# EAGLE design test3 (EAGLE 9.5.1)
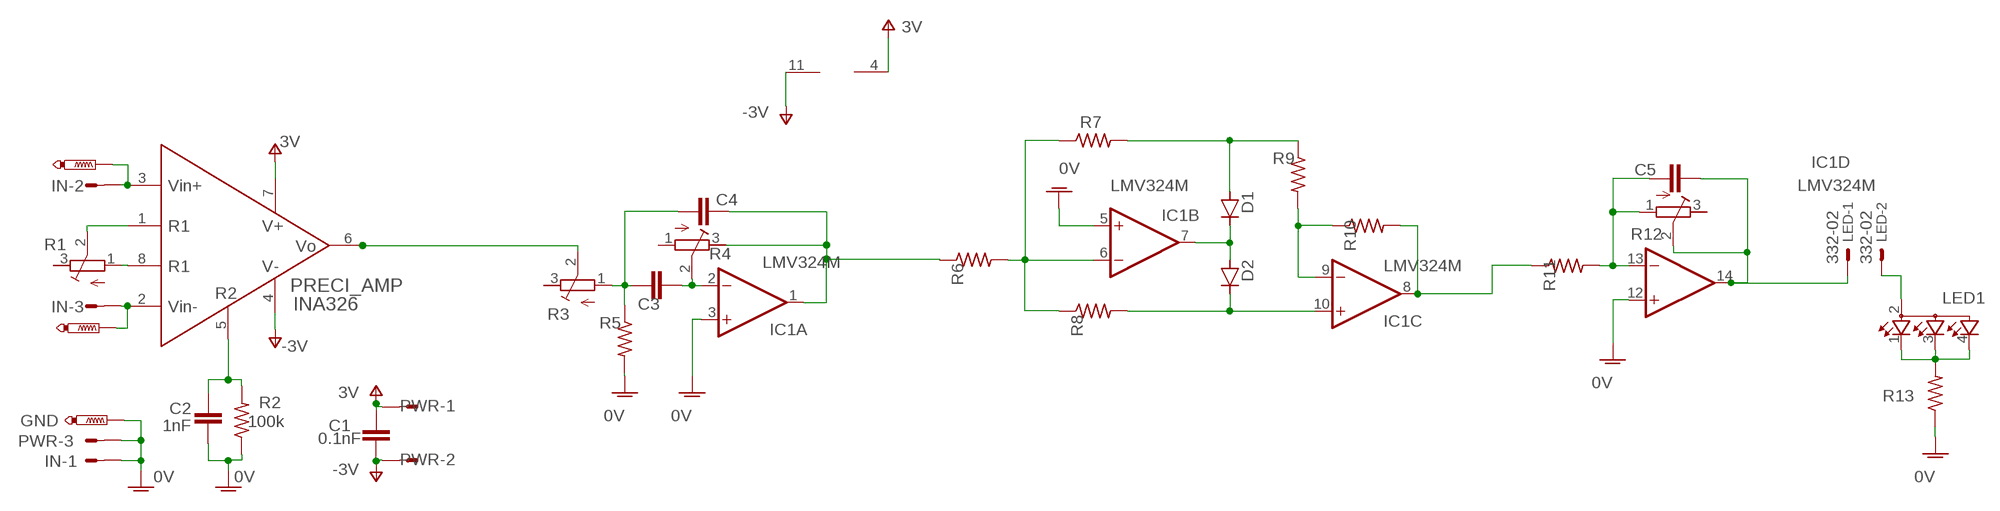
[diagram p0: schematic, sheet 1]

## Parts
C1  0.1nF  C-EUC0603  [C0603]
C2  1nF  C-EUC0603  [C0603]
C3  0.1nF  C-EUC0603  [C0603]
C4  0.1nF  C-EUC0603  [C0603]
C5  0.1nF  C-EUC0603  [C0603]
D1  D-SOD-80  [SOD80]
D2  D-SOD-80  [SOD80]
GND  PTR1PAD1-13  [P1-13]
IC1  LMV324M  [SO14]
IN  MT6-3  [MT6-3]
IN+  PTR1PAD1-13  [P1-13]
IN-  PTR1PAD1-13  [P1-13]
LED  332-02  [332-02]
LED1  TOPLED-3  [P-LCC-4-3]
PRECI_AMP  INA326  INA326EA/250  [SOP65P490X110-8N]
PWR  MT6-3  [MT6-3]
R1  R-TRIMM4G/J  [RTRIM4G/J]
R2  100k  R-US_R0603  [R0603]
R3  R-TRIMM4G/J  [RTRIM4G/J]
R4  R-TRIMM4G/J  [RTRIM4G/J]
R5  100k  R-US_R0603  [R0603]
R6  100k  R-US_R0603  [R0603]
R7  100k  R-US_R0603  [R0603]
R8  100k  R-US_R0603  [R0603]
R9  100k  R-US_R0603  [R0603]
R10  100k  R-US_R0603  [R0603]
R11  100k  R-US_R0603  [R0603]
R12  R-TRIMM4G/J  [RTRIM4G/J]
R13  100k  R-US_R0603  [R0603]

## Nets
GNDA: C2.1 GND.TP IC1.3(A:+IN) IC1.5(B:+IN) IC1.12(D:+IN) IN.1 PWR.3 R2.1 R5.2 R13.1 ; supply symbol labelled 0V
N$1: PRECI_AMP.8(R1) R1.1(A)
N$2: PRECI_AMP.1(R1_2) R1.2(S)
N$3: IN+.TP IN.2 PRECI_AMP.3(VIN+)
N$4: C2.2 PRECI_AMP.5(R2) R2.2
N$5: IN-.TP IN.3 PRECI_AMP.2(VIN-)
N$6: C3.1 IC1.2(A:-IN) R4.2(S)
N$7: C3.2 C4.2 R3.1(A) R5.1
N$8: C5.1 IC1.13(D:-IN) R11.2 R12.1(A)
N$9: PRECI_AMP.6(VO) R3.2(S)
N$10: IC1.6(B:-IN) R6.2 R7.1 R8.1
N$11: D2.1(C) IC1.10(C:+IN) R8.2
N$12: IC1.9(C:-IN) R9.2 R10.1
N$13: D1.1(C) D2.2(A) IC1.7(B:OUT)
N$14: D1.2(A) R7.2 R9.1
N$15: IC1.8(C:OUT) R10.2 R11.1
N$16: C5.2 IC1.14(D:OUT) LED.1 R12.2(S)
N$17: LED1.1(CRED) LED1.3(CBLUE) LED1.4(CGREEN) R13.2
N$20: LED1.2(A2) LED.2
N$23: C4.1 IC1.1(A:OUT) R4.3(E) R6.1
V+: C1.1 IC1.4(P:V+) PRECI_AMP.7(V+) PWR.1 ; supply symbol labelled 3V
V-: C1.2 IC1.11(P:V-) PRECI_AMP.4(V-) PWR.2 ; supply symbol labelled -3V
Unconnected: R1.3(E) R3.3(E) R4.1(A) R12.3(E)

## Library data of the parts
C1-C5 = rcl:C-EU: CAPACITOR, European symbol; SPICEPREFIX: C
D1 D2 = semicon-smd-ipc:D-: DIODE unfilled
GND IN+ IN- = testpad:PTR1: TEST PIN
IC1 = linear:LMV324?*: Quad General Purpose, Low Voltage, Rail-to-Rail Output Operational Amplifiers Source: http://www.national.com/mpf/LM/LMV321.html http://www.national.com/dt/lmv_qual.pdf; SPICEPREFIX: J
IN PWR = con-amp-mt6:MT6-3: AMP MT6 CONNECTOR; OC_FARNELL: unknown; OC_NEWARK: unknown
LED = con-garry:332-02: 2 Pin - 2mm Dual Row Source: www.mpe-connector.de / garry_shortform_2012.pdf
LED1 = led:TOPLED-3: OSRAM - Hyper Multi TOPLED® (RGB) LB E673, LV E673, LT E673 - Power TOPLED® Enhanced optical Power LED (HOP2000) LS E67B, LA E67B, LO E67B, LY E67B - Hyper Multi TOPLED® Enhanced optical Power LED (HOP2000 / ATON®) LATB T66B - Hyper Multi TOPLED® Hyper-Bright LED LATB T686 Source: http://www.osram.convergy.de/
PRECI_AMP = INA326EA_250:INA326EA/250: Precision, Rail-to-Rail I/O INSTRUMENTATION AMPLIFIER; DESCRIPTION: Precision, Low Drift, CMOS Instrumentation Amplifier 8-VSSOP -40 to 85; DIGI-KEY_PART_NUMBER: 296-15312-1-ND; DIGI-KEY_PURCHASE_URL: https://www.digikey.com/product-detail/en/texas-instruments/INA326EA-250/296-15312-1-ND/568254?utm_source=snapeda&utm_medium=aggregator&utm_campaign=symbol; MF: Texas Instruments; MP: INA326; PACKAGE: MSOP-8 Texas Instruments
R1 R3 R4 R12 = trimmer:R-TRIMM: Trimm resistor; SPICEMODEL: X; SPICEPREFIXL: POT
R2 R5-R11 R13 = rcl:R-US_: RESISTOR, American symbol; SPICEPREFIX: R

## Board
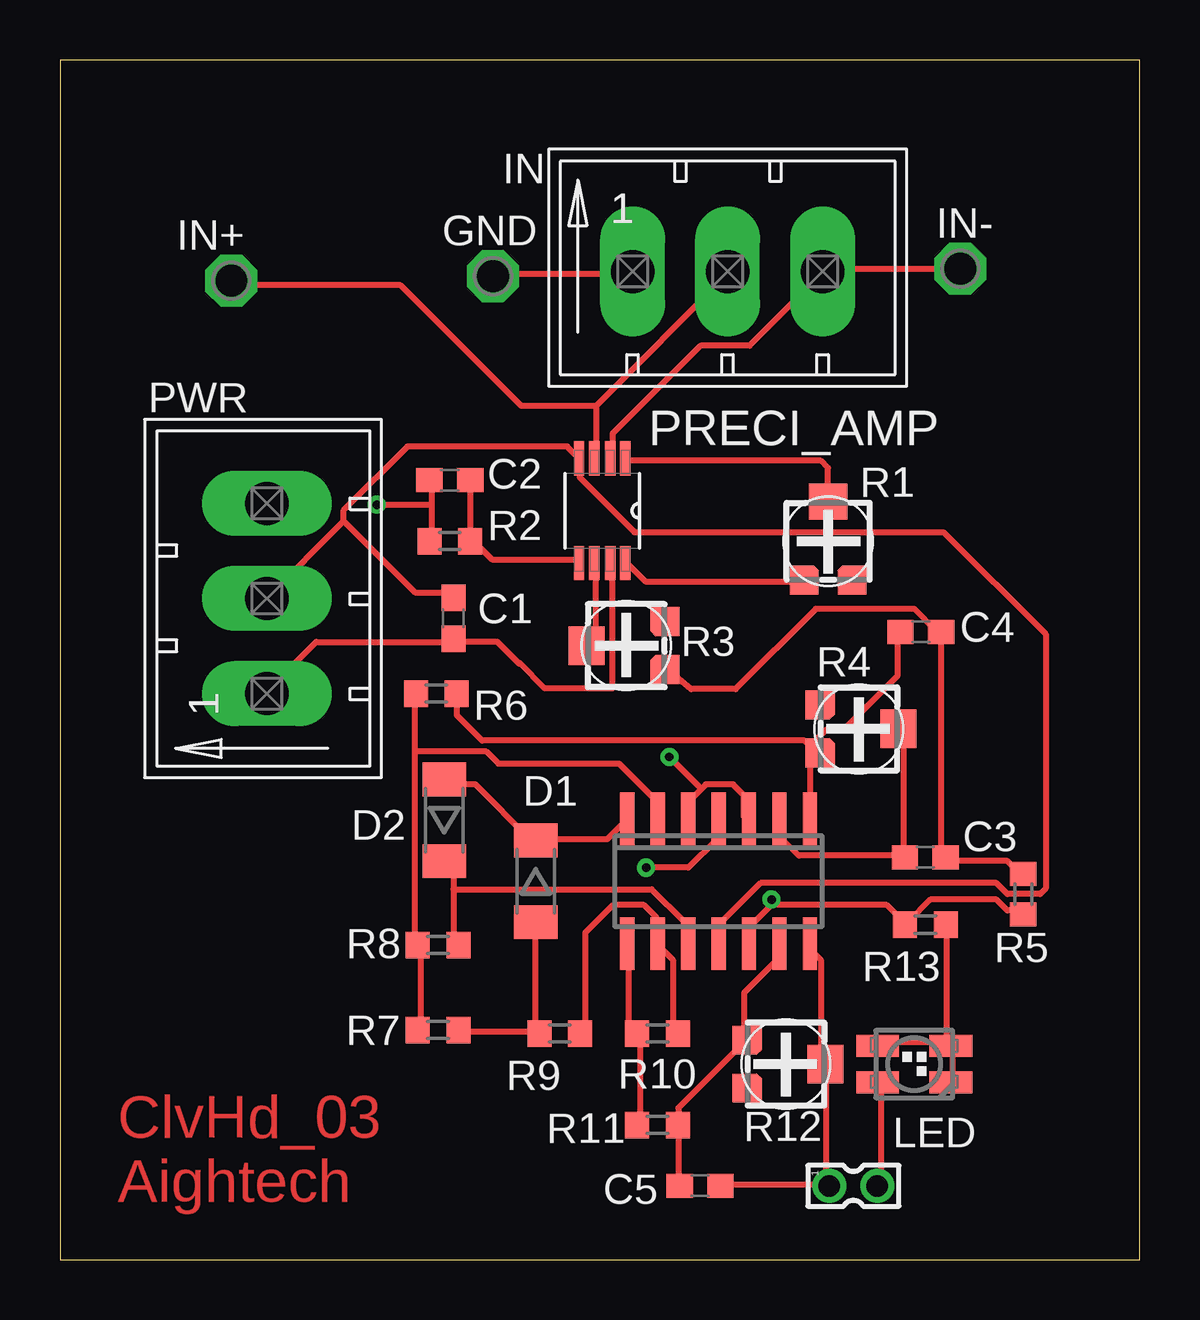
[diagram p1: board, top side]
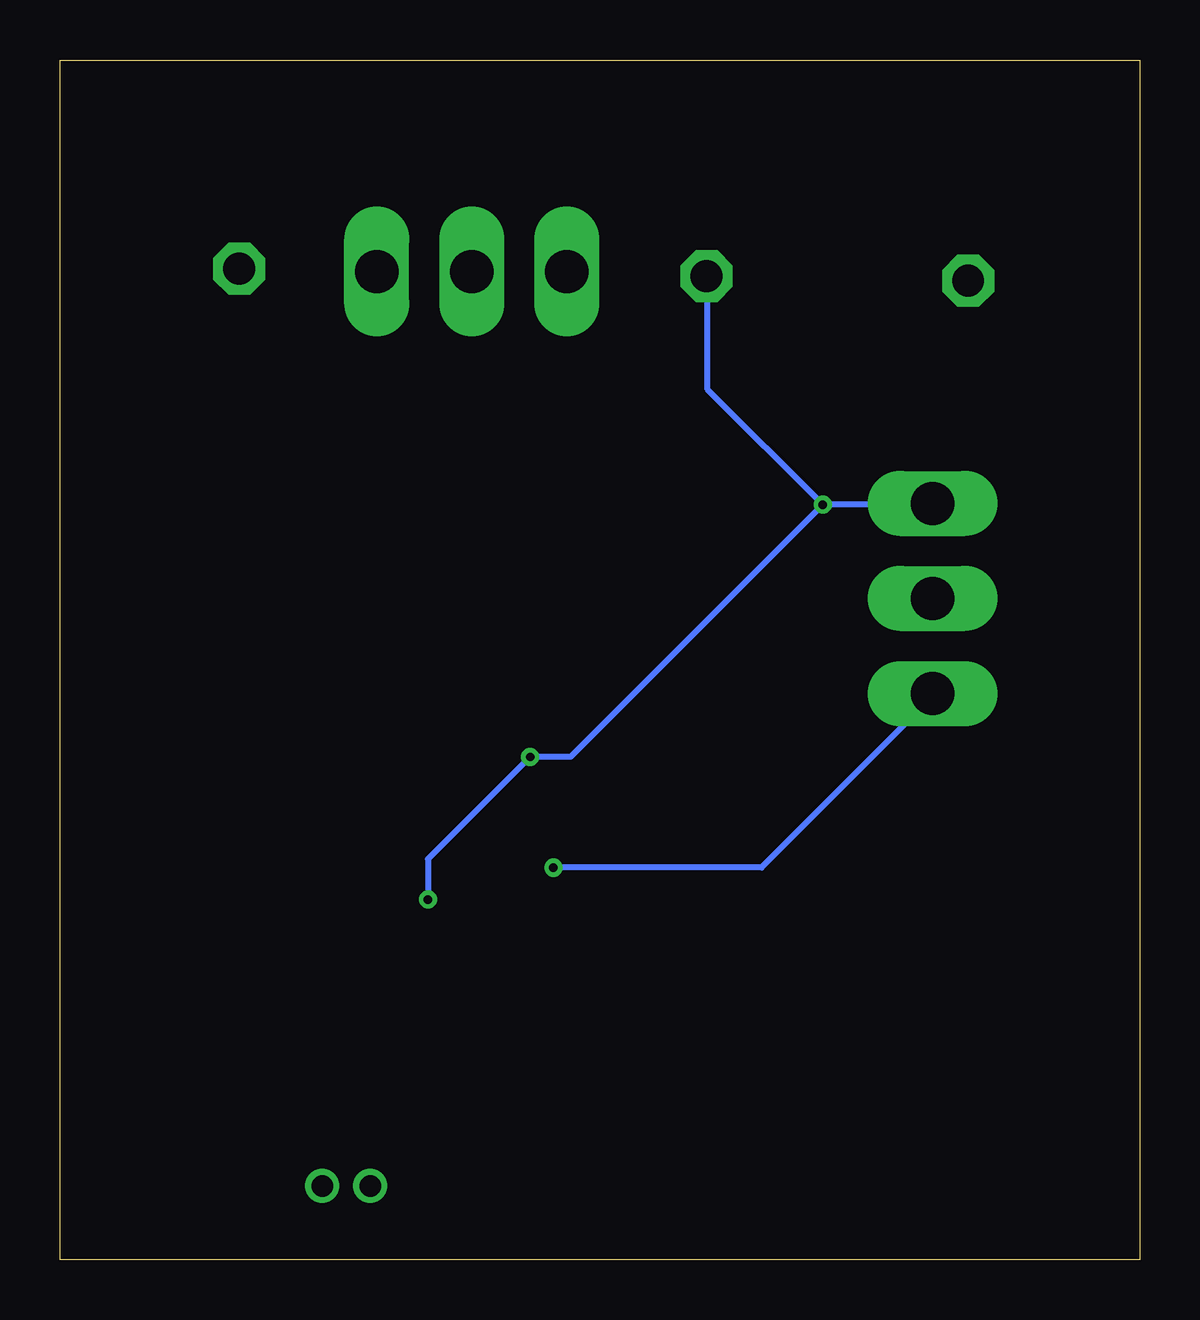
[diagram p2: board, bottom side, seen from below]

Size 45 x 50 mm. Coordinates in mm from the lower left corner, seen from the top.
Outline: 0,0 45,0 45,50 0,50 0,0
Copper layers (1*16): Top 0.035mm / dielectric 1.5mm / Bottom 0.035mm
Design rules "default *": minimum track width 10mil, minimum drill 0.35mm, track to track 8mil, track to pad 7mil, pad to pad 6mil, via to via 6mil, smd to smd 6mil, copper to edge 40mil, drill to drill 6mil, minimum pad ring 10mil, minimum via ring 8mil, stop-mask expansion 4mil, vias tented up to drill 0mil, thermal gap 10mil

### Footprints (pad centres in the part's own frame; a part is rotated, then mirrored left to right if it is on the bottom)
C0603 = smd 1.1 x 1: 1 -0.85,0; 2 0.85,0
SOD80 = smd 1.4 x 1.8: 1 -1.7,0; 2 1.7,0
P1-13 = drill 1.321 pad 2.159 octagon: TP 0,0
SO14 = smd 0.6 x 2.2: 1 -3.81,-2.6; 2 -2.54,-2.6; 3 -1.27,-2.6; 4 0,-2.6; 5 1.27,-2.6; 6 2.54,-2.6; 7 3.81,-2.6; 8 3.81,2.6; 9 2.54,2.6; 10 1.27,2.6; 11 0,2.6; 12 -1.27,2.6; 13 -2.54,2.6; 14 -3.81,2.6
MT6-3 = drill 1.803 long: 1 2.54,0; 2 6.502,0; 3 10.465,0
332-02 = drill 0.9 pad 1.27: 1 0,-1; 2 0,1
P-LCC-4-3 = smd 0.914 x 1.778: 1 -0.762,-1.524; 2 -0.762,1.524; 3 0.762,1.524; 4 0.762,-1.524
SOP65P490X110-8N = smd 1.422 x 0.432: 1 -2.184,0.965; 2 -2.184,0.33; 3 -2.184,-0.33; 4 -2.184,-0.965; 5 2.184,-0.965; 6 2.184,-0.33; 7 2.184,0.33; 8 2.184,0.965
RTRIM4G/J = smd 1.2 x 1: 1 -1,-1.72; 3 1,-1.72 | smd 1.6 x 1.5: 2 0,1.65 | smd 0.3 x 0.3 rotated 225: P$1 -0.6,-1.22; P$4 0.6,-1.22 | smd 1 x 0.25: P$2 -1.1,-1.13; P$3 1.1,-1.13
R0603 = smd 1 x 1.1: 1 -0.85,0; 2 0.85,0

### Placement (x,y rotation side)
C1  16.41,26.73 90 top
C2  16.25,32.48 0 top
C3  36.07,16.77 0 top
C4  35.88,26.16 0 top
C5  26.68,3.07 0 top
D1  19.83,15.77 270 top
D2  16.02,18.31 90 top
GND  18.05,40.99 0 top
IC1  27.45,15.77 180 top
IN  21.33,41.18 0 top
IN+  7.14,40.8 0 top
IN-  37.53,41.3 0 top
LED  33.07,3.07 270 top
LED1  35.61,8.15 90 top
PRECI_AMP  22.6,31.21 270 top
PWR  8.63,21.05 90 top
R1  32.02,29.94 0 top
R2  16.25,29.94 0 top
R3  23.6,25.59 90 top
R4  33.3,22.12 270 top
R5  40.15,15.23 270 top
R6  15.69,23.59 180 top
R7  15.76,9.57 0 top
R8  15.76,13.11 0 top
R9  20.83,9.42 0 top
R10  24.91,9.42 180 top
R11  24.91,5.61 0 top
R12  30.26,8.15 270 top
R13  36.07,13.96 0 top

### Tracks (layer width: path | path; a pad name or v marks a point on that pad's centre or on a via)
GNDA  (via drill 0.35)
  Top 0.254: GND.TP 18.23,41.06 23.72,41.06 IN.1 | R5.2 39.95,14.55 39.49,14.55 39.03,15.01 36.29,15.01 35.38,14.09 R13.1 35.15,14.09 34.46,14.78 29.66,14.78 | 29.66,14.78 28.75,13.86 28.75,13.18 IC1.12 | 26.23,19.12 26.23,18.43 IC1.5 26.23,19.12 | 26.73,19.62 26.92,19.8 28.06,19.8 28.52,19.35 28.52,18.43 IC1.3 | 26.73,19.62 26.23,19.12 | 15.49,31.46 15.49,32.38 C2.1 | 15.49,31.46 15.49,30.09 R2.1 | v13.2,31.46 15.49,31.46 | v25.4,20.95 26.73,19.62 | v29.66,15.01 29.66,14.78
  Bottom 0.254: v13.2,31.46 8.63,31.46 PWR.3 | v13.2,31.46 23.72,20.95 v25.4,20.95 29.66,16.69 v29.66,15.01 | v13.2,31.46 18,36.27 18,40.84 GND.TP
N$1
  Top 0.254: R1.1 31,28.26 24.4,28.26 23.72,28.95 PRECI_AMP.8
N$2
  Top 0.254: R1.2 32.02,32.99 31.72,33.29 23.72,33.29 PRECI_AMP.1
N$3
  Top 0.254: 22.35,35.58 22.35,33.52 PRECI_AMP.3 | 22.35,35.58 27.83,41.06 IN.2 | 22.35,35.58 19.23,35.58 14.2,40.61 7.26,40.61 IN+.TP
N$4
  Top 0.254: C2.2 17.09,32.38 17.09,30.09 R2.2 17.32,29.86 18,29.18 21.43,29.18 PRECI_AMP.5
N$5
  Top 0.254: PRECI_AMP.2 23.03,33.52 23.03,34.44 26.69,38.09 28.75,38.09 31.72,41.06 IN.3 31.95,41.29 37.43,41.29 IN-.TP
N$6
  Top 0.254: 35.15,16.83 35.15,22.09 R4.2 | 35.15,16.83 30.8,16.83 30.12,17.52 30.12,18.2 IC1.2 | 35.15,16.83 C3.1
N$7
  Top 0.254: R5.1 39.95,16.15 39.49,16.61 36.98,16.61 C3.2 36.75,16.83 36.75,25.98 C4.2 36.52,26.21 35.6,27.12 31.5,27.12 28.16,23.78 26.3,23.78 R3.1
N$8
  Top 0.254: C5.1 25.77,3.12 25.77,5.4 R11.2 25.77,5.63 25.77,6.32 28.52,9.06 R12.1 28.52,9.29 28.52,11.12 29.89,12.49 29.89,12.95 IC1.13
N$9
  Top 0.254: PRECI_AMP.6 22.35,28.95 22.35,25.83 R3.2
N$10
  Top 0.254: R7.1 15.03,9.75 15.03,12.95 R8.1 14.8,13.18 14.8,21.18 | IC1.6 24.86,18.43 24.86,19.12 23.3,20.68 18.27,20.68 17.77,21.18 14.8,21.18 | 14.8,21.18 14.8,23.46 R6.2
N$11
  Top 0.254: 16.4,15.43 16.4,16.38 16.17,16.61 D2.1 | 16.4,15.43 16.4,13.18 R8.2 | 16.4,15.43 24.66,15.43 26,14.09 26,13.18 IC1.10
N$12
  Top 0.254: R9.2 21.89,9.52 21.89,13.61 23.06,14.78 24.35,14.78 24.86,14.26 24.86,13.18 IC1.9 25.09,12.95 25.55,12.49 25.55,9.52 R10.1
N$13
  Top 0.254: IC1.7 23.49,18.2 22.8,17.52 19.83,17.52 D1.1 19.6,17.52 17.32,19.8 16.17,19.8 D2.2
N$14
  Top 0.254: 19.83,9.52 16.63,9.52 R7.2 | 19.83,9.52 19.83,13.86 D1.2 | 19.83,9.52 R9.1
N$15
  Top 0.254: R11.1 24.18,5.63 24.18,9.29 R10.2 23.95,9.52 23.72,9.75 23.72,12.95 IC1.8
N$16
  Top 0.254: IC1.14 31.26,12.95 31.72,12.49 31.72,8.38 R12.2 31.95,8.15 31.95,3.12 | 31.95,3.12 27.6,3.12 C5.2 | 31.95,3.12 LED.1
N$17
  Top 0.254: 36.98,9.06 36.98,13.86 R13.2 | LED1.1 37.2,7.46 37.2,8.83 LED1.4 36.98,9.06 | 36.98,9.06 34.23,9.06 LED1.3
N$20
  Top 0.254: LED1.2 34.23,7.23 34.23,3.12 LED.2
N$23
  Top 0.254: R6.1 16.54,22.7 17.6,21.63 31.03,21.63 31.26,21.41 | 31.26,21.41 31.49,21.18 R4.3 | 31.26,21.41 31.95,22.09 32.68,22.09 34.92,24.34 34.92,25.98 C4.1 | 31.26,21.41 R4.3 | IC1.1 31.26,18.43 31.26,20.72 31.49,20.95 R4.3
V+  (via drill 0.35)
  Top 0.254: 16.49,25.66 C1.1 | 19.15,24.88 19.17,24.86 | 19.17,24.86 20.2,23.82 23.03,23.82 23.03,28.95 PRECI_AMP.7 | v24.43,16.33 26.19,16.33 27.38,17.52 27.38,18.2 IC1.4 | C1.1 16.63,25.75 18.23,25.75 19.15,24.84 19.17,24.86 | C1.1 16.4,25.75 10.69,25.75 8.63,23.69 PWR.1
  Bottom 0.254: v24.43,16.33 15.76,16.33 8.63,23.46 PWR.1
V-
  Top 0.254: 16.49,27.72 C1.2 16.4,27.81 14.8,27.81 11.83,30.78 | 11.83,30.78 11.83,31.23 14.49,33.89 21.14,33.89 PRECI_AMP.4 21.66,33.29 21.66,32.61 23.95,30.32 36.83,30.32 41.09,26.06 41.09,15.46 40.86,15.23 39.49,15.23 39.03,15.69 29.2,15.69 27.6,14.09 27.6,13.18 IC1.11 | 11.83,30.78 8.63,27.58 PWR.2

### Text on the board
Top: ClvHd_03 / Aightech